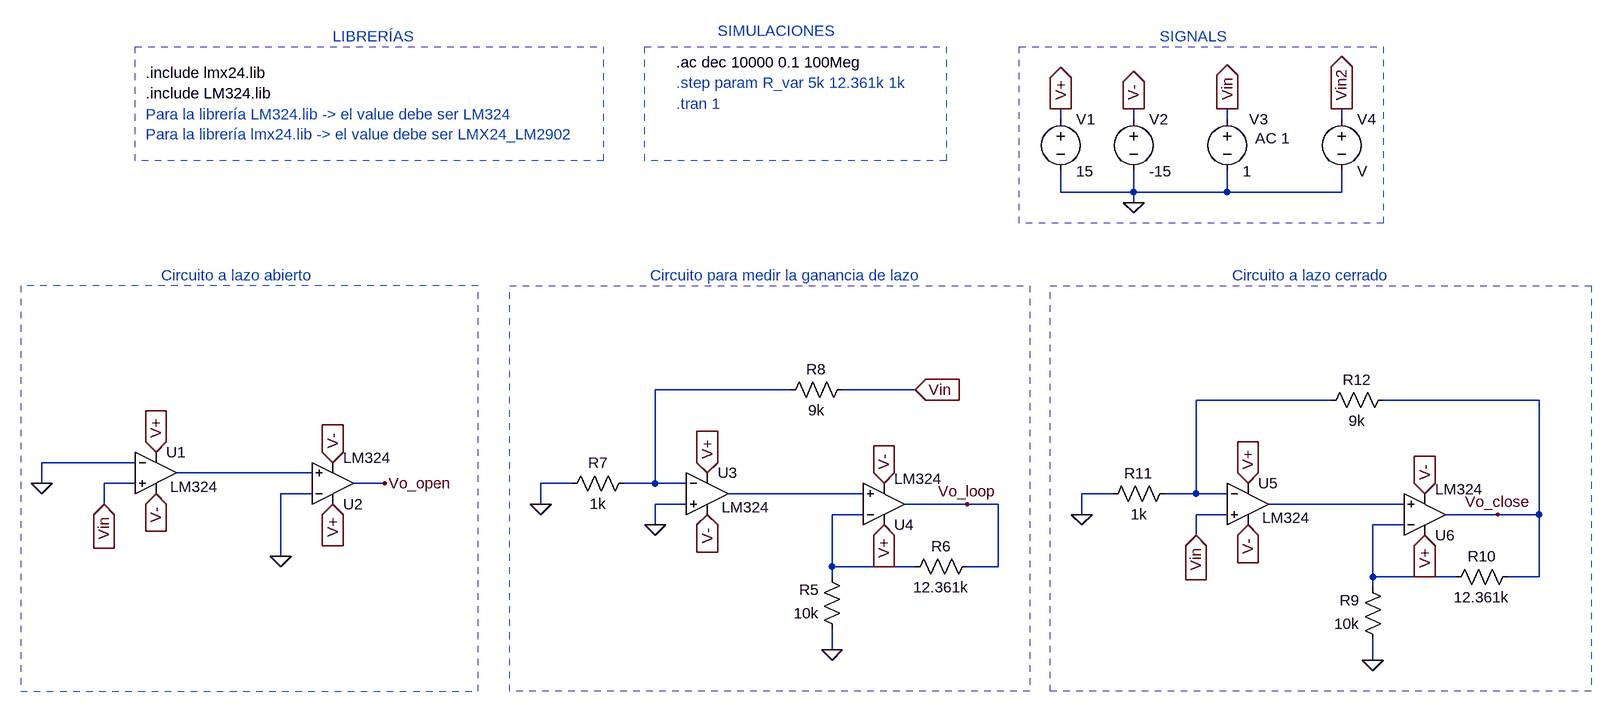
[diagram p0: schematic Circuito1_VFA_VFA.asc]
Circuito1_VFA_VFA.asc, the LTspice schematic file:
Version 4.1
SHEET 1 1668 680
WIRE 848 -256 848 -272
WIRE 960 -256 960 -272
WIRE 1104 -256 1104 -272
WIRE 1280 -256 1280 -272
WIRE 848 -144 848 -176
WIRE 960 -144 960 -176
WIRE 960 -144 848 -144
WIRE 1104 -144 1104 -176
WIRE 1104 -144 960 -144
WIRE 1280 -144 1280 -176
WIRE 1280 -144 1104 -144
WIRE 960 -128 960 -144
WIRE 432 160 224 160
WIRE 624 160 512 160
WIRE 1264 176 1056 176
WIRE 1584 176 1344 176
WIRE -576 272 -720 272
WIRE -304 288 -512 288
WIRE -720 304 -720 272
WIRE -576 304 -624 304
WIRE -192 304 -240 304
WIRE 96 304 48 304
WIRE 224 304 224 160
WIRE 224 304 176 304
WIRE 272 304 224 304
WIRE -304 320 -352 320
WIRE 544 320 336 320
WIRE 928 320 880 320
WIRE 1056 320 1056 176
WIRE 1056 320 1008 320
WIRE 1104 320 1056 320
WIRE -624 336 -624 304
WIRE 48 336 48 304
WIRE 272 336 224 336
WIRE 704 336 608 336
WIRE 752 336 704 336
WIRE 1376 336 1168 336
WIRE 544 352 496 352
WIRE 880 352 880 320
WIRE 1104 352 1056 352
WIRE 1520 352 1440 352
WIRE 1584 352 1584 176
WIRE 1584 352 1520 352
WIRE 224 368 224 336
WIRE 1376 368 1328 368
WIRE 1056 384 1056 352
WIRE -352 416 -352 320
WIRE 496 432 496 352
WIRE 624 432 496 432
WIRE 752 432 752 336
WIRE 752 432 704 432
WIRE 496 448 496 432
WIRE 1328 448 1328 368
WIRE 1456 448 1328 448
WIRE 1584 448 1584 352
WIRE 1584 448 1536 448
WIRE 1328 464 1328 448
WIRE 496 560 496 528
WIRE 1328 576 1328 544
FLAG -624 336 Vin
IOPIN -624 336 In
FLAG -352 416 0
FLAG -720 304 0
FLAG -544 256 V+
IOPIN -544 256 In
FLAG -272 336 V+
IOPIN -272 336 In
FLAG -544 320 V-
IOPIN -544 320 In
FLAG -272 272 V-
IOPIN -272 272 In
FLAG 960 -128 0
FLAG 848 -272 V+
IOPIN 848 -272 Out
FLAG 960 -272 V-
IOPIN 960 -272 Out
FLAG 1104 -272 Vin
IOPIN 1104 -272 Out
FLAG -192 304 Vo_open
FLAG 624 160 Vin
IOPIN 624 160 In
FLAG 496 560 0
FLAG 48 336 0
FLAG 304 288 V+
IOPIN 304 288 In
FLAG 576 368 V+
IOPIN 576 368 In
FLAG 304 352 V-
IOPIN 304 352 In
FLAG 576 304 V-
IOPIN 576 304 In
FLAG 704 336 Vo_loop
FLAG 1056 384 Vin
IOPIN 1056 384 In
FLAG 1328 576 0
FLAG 880 352 0
FLAG 1136 304 V+
IOPIN 1136 304 In
FLAG 1408 384 V+
IOPIN 1408 384 In
FLAG 1136 368 V-
IOPIN 1136 368 In
FLAG 1408 320 V-
IOPIN 1408 320 In
FLAG 1520 352 Vo_close
FLAG 224 368 0
FLAG 1280 -272 Vin2
IOPIN 1280 -272 Out
SYMBOL OpAmps\\opamp2 -544 224 R0
WINDOW 3 22 85 Left 2
SYMATTR Value LM324
SYMATTR InstName U1
SYMBOL OpAmps\\opamp2 -272 368 M180
WINDOW 3 16 103 Left 2
SYMATTR Value LM324
SYMATTR InstName U2
SYMBOL voltage 848 -272 R0
WINDOW 123 0 0 Left 0
WINDOW 39 0 0 Left 0
SYMATTR InstName V1
SYMATTR Value 15
SYMBOL voltage 960 -272 R0
WINDOW 123 0 0 Left 0
WINDOW 39 0 0 Left 0
SYMATTR InstName V2
SYMATTR Value -15
SYMBOL voltage 1104 -272 R0
WINDOW 123 43 45 Left 2
WINDOW 39 0 0 Left 0
WINDOW 0 34 16 Left 2
SYMATTR Value2 AC 1
SYMATTR InstName V3
SYMATTR Value 1
SYMBOL OpAmps\\opamp2 304 256 R0
WINDOW 3 22 85 Left 2
SYMATTR Value LM324
SYMATTR InstName U3
SYMBOL OpAmps\\opamp2 576 400 M180
WINDOW 3 16 103 Left 2
SYMATTR Value LM324
SYMATTR InstName U4
SYMBOL res 512 544 R180
WINDOW 0 36 76 Left 2
WINDOW 3 36 40 Left 2
SYMATTR InstName R5
SYMATTR Value 10k
SYMBOL res 608 448 R270
WINDOW 0 32 56 VTop 2
WINDOW 3 0 56 VBottom 2
SYMATTR InstName R6
SYMATTR Value 12.361k
SYMBOL res 80 320 R270
WINDOW 0 32 56 VTop 2
WINDOW 3 0 56 VBottom 2
SYMATTR InstName R7
SYMATTR Value 1k
SYMBOL res 416 176 R270
WINDOW 0 32 56 VTop 2
WINDOW 3 0 56 VBottom 2
SYMATTR InstName R8
SYMATTR Value 9k
SYMBOL OpAmps\\opamp2 1136 272 R0
WINDOW 3 22 85 Left 2
SYMATTR Value LM324
SYMATTR InstName U5
SYMBOL OpAmps\\opamp2 1408 416 M180
WINDOW 3 16 103 Left 2
SYMATTR Value LM324
SYMATTR InstName U6
SYMBOL res 1344 560 R180
WINDOW 0 36 76 Left 2
WINDOW 3 36 40 Left 2
SYMATTR InstName R9
SYMATTR Value 10k
SYMBOL res 1440 464 R270
WINDOW 0 32 56 VTop 2
WINDOW 3 0 56 VBottom 2
SYMATTR InstName R10
SYMATTR Value 12.361k
SYMBOL res 912 336 R270
WINDOW 0 32 56 VTop 2
WINDOW 3 0 56 VBottom 2
SYMATTR InstName R11
SYMATTR Value 1k
SYMBOL res 1248 192 R270
WINDOW 0 32 56 VTop 2
WINDOW 3 0 56 VBottom 2
SYMATTR InstName R12
SYMATTR Value 9k
SYMBOL voltage 1280 -272 R0
SYMATTR InstName V4
TEXT -560 -296 Left 2 !.include LM324.lib
TEXT 256 -280 Left 2 ;.tran 1
TEXT 256 -344 Left 2 !.ac dec 10000 0.1 100Meg
TEXT 256 -312 Left 2 ;.step param R_var 5k 12.361k 1k
TEXT -560 -328 Left 2 !.include lmx24.lib
TEXT -560 -264 Left 2 ;Para la librería LM324.lib -> el value debe ser LM324\nPara la librería lmx24.lib -> el value debe ser LMX24_LM2902
TEXT -272 -384 Left 2 ;LIBRERÍAS
TEXT 320 -392 Left 2 ;SIMULACIONES
TEXT 1000 -384 Left 2 ;SIGNALS
TEXT -536 -16 Left 2 ;Circuito a lazo abierto
TEXT 216 -16 Left 2 ;Circuito para medir la ganancia de lazo
TEXT 1112 -16 Left 2 ;Circuito a lazo cerrado
RECTANGLE Normal 144 -192 -576 -368 2
RECTANGLE Normal 672 -192 208 -368 2
RECTANGLE Normal 800 624 0 0 2
RECTANGLE Normal 1664 624 832 0 2
RECTANGLE Normal -752 624 -48 0 2
RECTANGLE Normal 1344 -96 784 -368 2

The netlist it stands for:
* Circuito1_VFA_VFA.asc
X§U1 Vin 0 V+ V- N003 LM324  ; pins In+ In- V+ V- OUT
X§U2 N003 0 V+ V- Vo_open LM324  ; pins In+ In- V+ V- OUT
V1 V+ 0 15
V2 V- 0 -15
V3 Vin 0 1 AC 1
X§U3 0 N001 V+ V- N004 LM324  ; pins In+ In- V+ V- OUT
X§U4 N004 N006 V+ V- Vo_loop LM324  ; pins In+ In- V+ V- OUT
R5 0 N006 10k
R6 N006 Vo_loop 12.361k
R7 0 N001 1k
R8 N001 Vin 9k
X§U5 Vin N002 V+ V- N005 LM324  ; pins In+ In- V+ V- OUT
X§U6 N005 N007 V+ V- Vo_close LM324  ; pins In+ In- V+ V- OUT
R9 0 N007 10k
R10 N007 Vo_close 12.361k
R11 0 N002 1k
R12 N002 Vo_close 9k
V4 Vin2 0 V
.include LM324.lib
* .tran 1
.ac dec 10000 0.1 100Meg
* .step param R_var 5k 12.361k 1k
.include lmx24.lib
* Para la librería LM324.lib -> el value debe ser LM324
* Para la librería lmx24.lib -> el value debe ser LMX24_LM2902
* LIBRERÍAS
* SIMULACIONES
* SIGNALS
* Circuito a lazo abierto
* Circuito para medir la ganancia de lazo
* Circuito a lazo cerrado
.backanno
.end